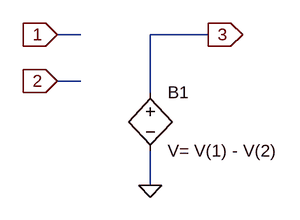
[diagram p0: schematic Sub.asc]
Sub.asc, the LTspice schematic file:
Version 4
SHEET 1 880 680
WIRE 192 -16 160 -16
WIRE 368 -16 288 -16
WIRE 192 48 160 48
WIRE 288 64 288 -16
WIRE 288 192 288 144
FLAG 160 -16 1
IOPIN 160 -16 In
FLAG 160 48 2
IOPIN 160 48 In
FLAG 368 -16 3
IOPIN 368 -16 Out
FLAG 288 192 0
SYMBOL bv 288 48 R0
SYMATTR InstName B1
SYMATTR Value V= V(1) - V(2)

The netlist it stands for:
* Sub.asc
B1 3 0 V= V(1) - V(2)
.backanno
.end